# EasyEDA Pro project YYT_MiniOdrive_V2.6(最终版) .epro, board PCB_SimpleFOC
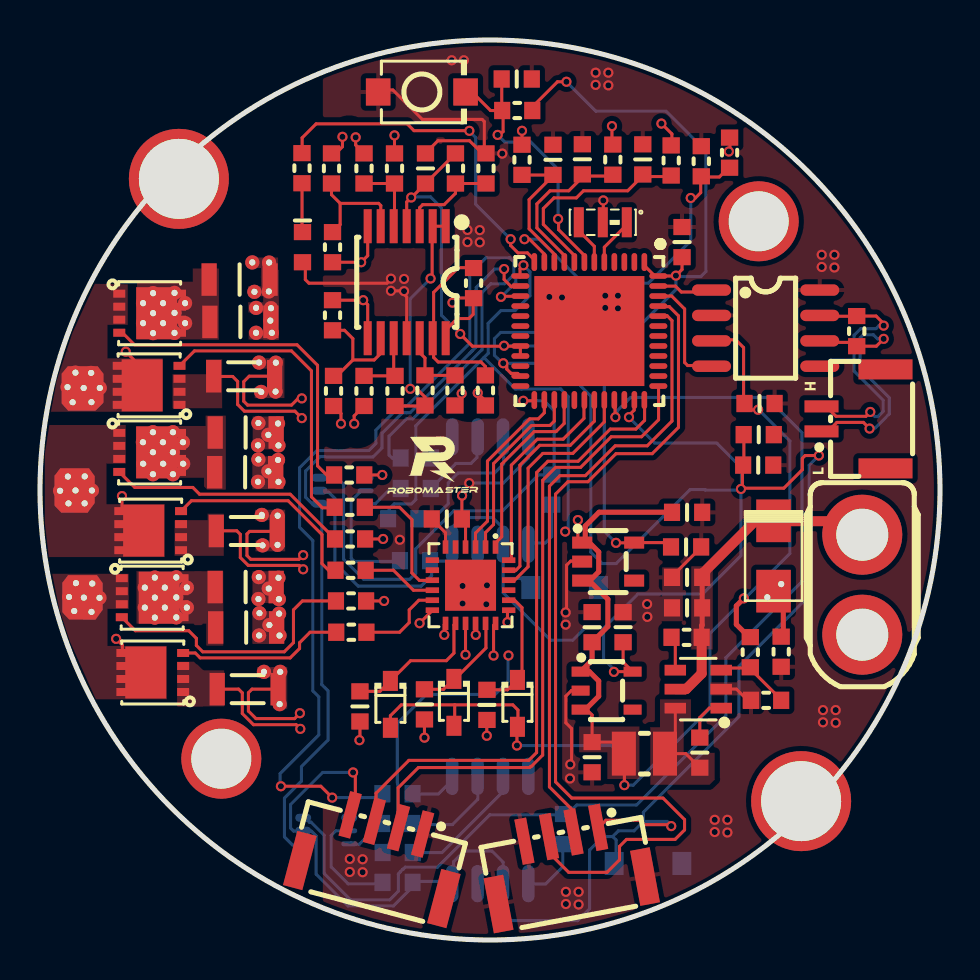
[diagram p1: board, top side]
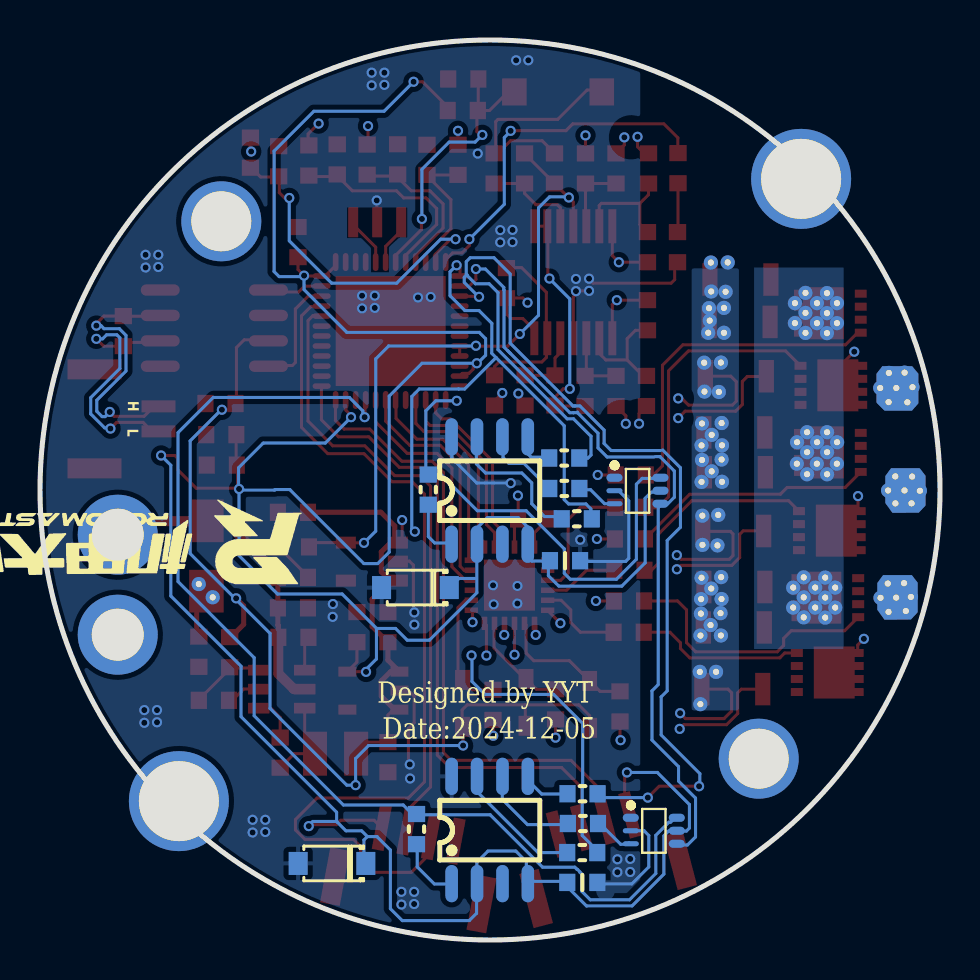
[diagram p2: board, bottom side, seen from below]

Outline 45 x 45 mm; copper layers: Top Layer, Inner1, Inner2, Bottom Layer. Coordinates in mm from the lower left corner of the outline.
Outline path: circle c22.5,22.5 r22.5
Stack: Top Layer 0.035mm 外层铜厚1oz / Dielectric1 0.2104mm 7628 RC49% 8.6mil / Inner1 0.0152mm 内层铜厚 / Dielectric2 1.065mm 1.1mm H/HOZ Copper / Inner2 0.0152mm 内层铜厚 / Dielectric3 0.2104mm 7628 RC49% 8.6mil / Bottom Layer 0.035mm 外层铜厚1oz

## Design rules (mm)
net CANH: DP1
net CANL: DP1
template: 用户自定义配置
spacing Default (default): track to track 0.152, other pairs 0 to 0.152
spacing copperThickness1oz: track to track 0.102, other pairs 0.152 to 0.3
spacing copperThickness2oz: track to track 0.203, other pairs 0.152 to 0.3
track width Default (default): min 0.152, default 0.254, max 25.4
track width copperThickness1oz: min 0.127, default 0.152, max 2.54
track width copperThickness2oz: min 0.203, default 0.254, max 2.54
differential pair differentialPair (default): width min 0.127, default 0.254, max 2.54; gap min 0.152, default 0.152
via Default (default): diameter min 0.5, default 0.5, max 100.025; hole min 0.305, default 0.305, max 59.995
via viaSize: diameter min 0.5, default 0.508, max 10; hole min 0.3, default 0.305, max 6.299
pour e9712 uses gge5858

## Placement (name value [footprint] x y rotation side)
C11  1uF  [C0603_SMALL]  22.35 11.76 90 top
C30  1uF  [C0603_SMALL]  32.3 19.66 180 top
C31  1uF  [C0603_SMALL]  32.35 21.38 180 top
C33  10uF  [C1206_SMALL]  10.02 30.91 180 top
C89  10uF  [C0603_SMALL]  27.61 15.64 270 top
C90  10uF  [C0603_SMALL]  29.16 15.64 270 top
C91  1nF  [C0603_SMALL]  25.65 39.01 270 top
C92  1nF  [C0603_SMALL]  27.12 39.03 270 top
C93  1nF  [C0603_SMALL]  30.14 39.03 270 top
C94  100nF  [C0603_SMALL]  19.27 38.58 270 top
C106  10uF  [C0603_SMALL]  20.34 21.05 180 top
C107  1uF  [C0603_SMALL]  16 11.68 90 top
C108  1uF  [C0603_SMALL]  19.22 11.78 90 top
C121  10uF  [C1206_SMALL]  10.26 23.39 180 top
C122  10uF  [C1206_SMALL]  10.31 15.63 180 top
C149  0.1uF  [C0603_SMALL]  35.91 23.74 180 top
C150  0.1uF  [C0603_SMALL]  35.94 25.27 180 top
C151  0.1uF  [C0603_SMALL]  32.1 34.89 270 top
C152  100nF  [C0603_SMALL]  32.99 9.37 270 top
C156  22uF  [C1206_SMALL]  9.98 33.02 0 top
C157  22uF  [C1206_SMALL]  10.28 25.38 0 top
C158  22uF  [C1206_SMALL]  10.28 17.65 0 top
C159  100nF  [C0603_SMALL]  32.35 16.61 180 top
C160  4.7uF  [C0603_SMALL]  32.35 18.13 180 top
C161  10uF  [C0603_SMALL]  27.61 9.14 270 top
C162  100nF  [C0603_SMALL]  23.84 43.05 0 top
C163  0.1uF  [C0603_SMALL]  18.75 18.97 0 bottom
C164  0.1uF  [C0603_SMALL]  17.88 2.88 0 bottom
C165  0.1uF  [C0603_SMALL]  35.98 26.82 0 top
CHIP_EN3  TS-1088-AR02016  [SW-SMD_L3.9-W3.0-P4.45]  19.09 42.4 0 top
CN1  XT30UPB-F  [CONN-TH_XT30UPB-F]  41.11 17.77 270 top
CN2  GH1.25-2P卧贴  [CONN-SMD_2P-P1.25_X1251WRS-02HF-LPSW]  40.68 26.06 90 top
D5  SMF5.0A  [SOD-123_L2.8-W1.8-LS3.7-RD]  26.23 17.62 0 bottom
D9  SMAJ18CA  [DO214AC]  36.68 19.2 90 top
D10  1N5819WS  [SOD-323_L1.8-W1.3-LS2.5-RD]  17.52 11.78 270 top
D11  1N5819WS  [SOD-323_L1.8-W1.3-LS2.5-RD]  20.7 11.88 270 top
D12  1N5819WS  [SOD-323_L1.8-W1.3-LS2.5-RD]  23.87 11.83 270 top
D14  SMF5.0A  [SOD-123_L2.8-W1.8-LS3.7-RD]  30.4 3.83 0 bottom
L3  22uH  [IND-SMD_L2.5-W2.0]  30.22 9.32 0 top
LED9  NCD0603B1  [LED0603_RED_SMALL]  13.12 34.64 270 top
NOREF  -  [Pad_e6]  1.38 27.64 0 top
NOREF#2  -  [Pad_e5391]  11.42 23.43 90 top
NOREF#3  -  [Pad_e32]  2.23 21.83 0 top
NOREF#4  -  [Pad_e345]  6.73 30.36 90 top
NOREF#5  -  [Pad_e254]  11.92 24.73 90 top
NOREF#6  -  [Pad_e92]  6.94 38.06 0 top
NOREF#7  -  [Pad_e340]  6.73 32.36 90 top
NOREF#8  -  [Pad_e483]  36.37 17.14 90 top
NOREF#9  -  [Pad_e39]  1.8 17.84 0 top
NOREF#10  -  [Pad_e316]  6.81 17.13 90 top
NOREF#11  -  [Pad_e5400]  11.94 17.05 90 top
NOREF#12  -  [Pad_e335]  5.65 31.34 90 top
NOREF#13  -  [Pad_e4221]  11.2 13.41 90 top
NOREF#14  -  [Pad_e342]  7.25 31.84 90 top
NOREF#15  -  [Pad_e0]  2.13 27.58 90 top
NOREF#16  -  [Pad_e1]  1.73 22.47 90 top
NOREF#17  -  [Pad_e8]  2.99 27.6 0 top
NOREF#18  -  [Pad_e344]  7.25 30.84 90 top
NOREF#19  -  [Pad_e114]  9.06 9.06 0 top
NOREF#20  -  [Pad_e5394]  11.92 22.91 90 top
NOREF#21  -  [Pad_e33]  2.19 17.12 0 top
NOREF#22  -  [Pad_e5404]  10.95 15.23 90 top
NOREF#23  -  [Pad_e333]  5.65 30.34 90 top
NOREF#24  -  [Pad_e27]  1.01 22.46 0 top
NOREF#25  -  [Pad_e244]  11.59 30.36 90 top
NOREF#26  -  [Pad_e320]  5.65 25.39 0 top
NOREF#27  -  [Pad_e322]  5.65 24.39 0 top
NOREF#28  -  [Pad_e338]  5.65 32.34 90 top
NOREF#29  -  [Pad_e5403]  10.97 16.34 90 top
NOREF#30  -  [Pad_e304]  12.01 13.41 90 top
NOREF#31  -  [Pad_e31]  1.42 21.83 0 top
NOREF#32  -  [Pad_e315]  7.34 17.62 90 top
NOREF#33  -  [Pad_e318]  7.34 16.62 90 top
NOREF#34  -  [Pad_e281]  11.88 21.21 90 top
NOREF#35  -  [Pad_e5393]  11.9 24 90 top
NOREF#36  -  [Pad_e5399]  10.92 17.05 90 top
NOREF#37  -  [Pad_e246]  11.55 31.59 90 top
NOREF#38  -  [Pad_e4692]  11.46 33.87 90 top
NOREF#39  -  [Pad_e5392]  10.92 24.03 90 top
NOREF#40  -  [Pad_e4231]  11.06 27.4 90 top
NOREF#41  -  [Pad_e768]  11.79 28.87 90 top
NOREF#42  -  [Pad_e307]  5.24 16.62 90 top
NOREF#43  -  [Pad_e29]  1.39 23.17 0 top
NOREF#44  -  [Pad_e38]  2.61 17.82 0 top
NOREF#45  -  [Pad_e313]  6.24 17.62 90 top
NOREF#46  -  [Pad_e326]  6.65 24.39 0 top
NOREF#47  -  [Pad_e253]  10.9 24.73 90 top
NOREF#48  -  [Pad_e319]  6.81 16.13 90 top
NOREF#49  -  [Pad_e325]  7.15 24.89 0 top
NOREF#50  -  [Pad_e314]  6.81 18.13 90 top
NOREF#51  -  [Pad_e3]  2.12 17.13 90 top
NOREF#52  -  [Pad_e280]  11.88 19.76 90 top
NOREF#53  -  [Pad_e42]  2.57 16.4 0 top
NOREF#54  -  [Pad_e5395]  10.9 22.91 90 top
NOREF#55  -  [Pad_e310]  5.74 17.12 90 top
NOREF#56  -  [Pad_e332]  5.15 30.84 90 top
NOREF#57  -  [Pad_e339]  6.15 31.84 90 top
NOREF#58  -  [Pad_e323]  6.15 24.89 0 top
NOREF#59  -  [Pad_e245]  11.51 30.97 90 top
NOREF#60  -  [Pad_e18]  2.57 26.89 0 top
NOREF#61  -  [Pad_e309]  6.24 16.62 90 top
NOREF#62  -  [Pad_e328]  6.65 23.29 0 top
NOREF#63  -  [Pad_e2]  1.73 22.47 90 top
NOREF#64  -  [Pad_e4689]  11.44 32.43 90 top
NOREF#65  -  [Pad_e26]  1.78 22.48 0 top
NOREF#66  -  [Pad_e482]  37.06 17.8 90 top
NOREF#67  -  [Pad_e28]  2.6 22.48 0 top
NOREF#68  -  [Pad_e4203]  11.09 21.25 90 top
NOREF#69  -  [Pad_e324]  6.65 25.39 0 top
NOREF#70  -  [Pad_e7]  2.18 27.6 0 top
NOREF#71  -  [Pad_e4691]  10.62 33.88 90 top
NOREF#72  -  [Pad_e9]  1.63 26.89 0 top
NOREF#73  -  [Pad_e5390]  11.42 25.26 90 top
NOREF#74  -  [Pad_e5398]  10.94 18.14 90 top
NOREF#75  -  [Pad_e308]  5.74 16.12 90 top
NOREF#76  -  [Pad_e5405]  11.98 15.22 90 top
NOREF#77  -  [Pad_e5]  2.56 28.35 0 top
NOREF#78  -  [Pad_e247]  10.8 31.61 90 top
NOREF#79  -  [Pad_e330]  5.65 23.29 0 top
NOREF#80  -  [Pad_e98]  38.06 6.94 0 top
NOREF#81  -  [Pad_e4199]  11.13 19.73 90 top
NOREF#82  -  [Pad_e343]  6.73 31.36 90 top
NOREF#83  -  [Pad_e4690]  10.72 32.41 90 top
NOREF#84  -  [Pad_e255]  11.9 25.83 90 top
NOREF#85  -  [Pad_e336]  5.15 31.84 90 top
NOREF#86  -  [Pad_e162]  2.13 27.58 90 top
NOREF#87  -  [Pad_e30]  2.24 23.18 0 top
NOREF#88  -  [Pad_e89]  35.94 35.94 0 top
NOREF#89  -  [Pad_e41]  1.71 16.45 0 top
NOREF#90  -  [Pad_e37]  2.97 17.11 0 top
NOREF#91  -  [Pad_e5402]  11.47 15.75 90 top
NOREF#92  -  [Pad_e311]  5.24 17.62 90 top
NOREF#93  -  [Pad_e4230]  10.95 28.87 90 top
NOREF#94  -  [Pad_e321]  5.15 24.89 0 top
NOREF#95  -  [Pad_e329]  6.16 23.81 0 top
NOREF#96  -  [Pad_e5397]  11.44 17.57 90 top
NOREF#97  -  [Pad_e303]  11.98 11.79 90 top
NOREF#98  -  [Pad_e40]  1.45 17.15 0 top
NOREF#99  -  [Pad_e331]  5.16 23.81 0 top
NOREF#100  -  [Pad_e4]  1.77 28.37 0 top
NOREF#101  -  [Pad_e769]  11.78 27.42 90 top
NOREF#102  -  [Pad_e257]  10.92 25.85 90 top
NOREF#103  -  [Pad_e334]  6.15 30.84 90 top
NOREF#104  -  [Pad_e5401]  11.95 16.32 90 top
NOREF#105  -  [Pad_e163]  2.12 17.13 90 top
NOREF#106  -  [Pad_e312]  5.74 18.12 90 top
NOREF#107  -  [Pad_e243]  10.8 30.36 90 top
NOREF#108  -  [Pad_e5396]  11.92 18.11 90 top
NOREF#109  -  [Pad_e327]  7.16 23.81 0 top
Q19  -  [DFN-8_L3.2-W3.1-P0.65-LS3.4-BL]  5.48 31.34 270 top
Q20  -  [DFN-8_L3.2-W3.1-P0.65-LS3.4-BL]  5.48 24.38 270 top
Q21  -  [DFN-8_L3.2-W3.1-P0.65-LS3.4-BL]  5.61 17.11 270 top
Q22  -  [DFN-8_L3.2-W3.1-P0.65-LS3.4-BL]  5.46 27.73 90 top
Q23  -  [DFN-8_L3.2-W3.1-P0.65-LS3.4-BL]  5.53 20.47 90 top
Q24  -  [DFN-8_L3.2-W3.1-P0.65-LS3.4-BL]  5.64 13.38 90 top
R20  1kΩ  [R0603_SMALL]  22.3 38.58 90 top
R21  1kΩ  [R0603_SMALL]  20.77 38.58 270 top
R23  10Ω  [R0603_SMALL]  15.55 16.95 180 top
R61  0Ω  [R0603_SMALL]  37.06 14.41 270 top
R67  100kΩ  [R0603_SMALL]  21.68 32.84 270 top
R71  100kΩ  [R0603_SMALL]  14.63 31.24 90 top
R75  100kΩ  [R0603_SMALL]  14.63 34.64 270 top
R76  100kΩ  [R0603_SMALL]  17.72 38.58 270 top
R77  100kΩ  [R0603_SMALL]  17.75 27.45 90 top
R78  100kΩ  [R0603_SMALL]  19.25 27.48 90 top
R79  2kΩ  [R0603_SMALL]  22.27 27.48 270 top
R80  2kΩ  [R0603_SMALL]  20.75 27.48 270 top
R81  2kΩ  [R0603_SMALL]  14.68 27.45 270 top
R82  2kΩ  [R0603_SMALL]  16.2 27.45 270 top
R83  2kΩ  [R0603_SMALL]  14.57 38.58 90 top
R84  2kΩ  [R0603_SMALL]  16.2 38.58 90 top
R85  22Ω  [R0603_SMALL]  24.1 39.01 90 top
R86  22Ω  [R0603_SMALL]  28.64 39.02 90 top
R87  22Ω  [R0603_SMALL]  31.56 38.98 90 top
R92  10kΩ  [R0603_SMALL]  32.33 15.13 180 top
R93  10kΩ  [R0603_SMALL]  36.31 11.98 180 top
R94  52.3kΩ  [R0603_SMALL]  35.51 14.39 270 top
R106  10Ω  [R0603_SMALL]  15.46 23.25 180 top
R107  10Ω  [R0603_SMALL]  15.49 21.64 180 top
R108  10Ω  [R0603_SMALL]  15.5 20.05 180 top
R109  10Ω  [R0603_SMALL]  15.53 18.49 180 top
R110  10Ω  [R0603_SMALL]  15.57 15.39 180 top
R116  4.7kΩ  [R0603_SMALL]  13.1 38.59 270 top
R117  10kΩ  [R0603_SMALL]  23.86 41.47 180 top
R118  10kΩ  [R0603_SMALL]  34.48 39.37 90 top
R119  1kΩ  [R0603_SMALL]  33.06 38.94 270 top
R120  22Ω  [R0603_SMALL]  25.59 22.52 270 bottom
R121  22Ω  [R0603_SMALL]  18.16 21.06 0 bottom
R122  22Ω  [R0603_SMALL]  18.78 22.58 0 bottom
R123  22Ω  [R0603_SMALL]  18.79 24.1 0 bottom
R124  22Ω  [R0603_SMALL]  26.18 5.55 270 bottom
R125  22Ω  [R0603_SMALL]  17.89 4.37 0 bottom
R126  22Ω  [R0603_SMALL]  17.85 5.83 0 bottom
R127  22Ω  [R0603_SMALL]  17.87 7.31 0 bottom
R128  120  [R0603_SMALL]  40.84 30.44 90 top
U13  LP5907MFX-3.3/NOPB  [SOT-23-5_L3.0-W1.7-P0.95-LS2.8-BR]  28.41 18.92 180 top
U16  RS724XQ  [TSSOP-14_L5.0-W4.4-P0.65-LS6.4-BL]  18.33 32.89 180 top
U19  LGS5148  [SOT-23-6_L2.9-W1.6-P0.95-LS2.8-BL]  32.91 12.54 90 top
U20  FD6288Q  [QFN-24_L4.0-W4.0-P0.50-BL-EP2.6]  21.53 17.74 180 top
U60  STM32G431CBU6  [UFQFPN-48_L7.0-W7.0-P0.50-BL-EP]  27.47 30.45 180 top
U61  XC6210B332MR  [SOT-25_L3.0-W1.6-P0.95-LS2.8-BL]  28.33 12.47 270 top
U63  2mΩ  [R1206_SMALL]  10.21 28.19 180 top
U64  2mΩ  [R1206_SMALL]  10.34 20.45 180 top
U65  2mΩ  [R1206_SMALL]  10.38 12.54 180 top
U66  GH1.25-4P卧贴  [CONN-SMD_4P-P1.25_GH1.25-4P]  16.96 4.4 345.2 top
U67  GH1.25-4P卧贴  [CONN-SMD_4P-P1.25_GH1.25-4P]  26.33 3.89 10.6 top
U70  MT6816CT-STD  [SOP-8_L4.9-W3.9-P1.27-LS6.0-BL]  22.52 22.47 180 bottom
U71  MT6816CT-STD  [SOP-8_L4.9-W3.9-P1.27-LS6.0-BL]  22.51 5.5 180 bottom
U72  CH443K  [SC70-6_L2.1-W1.3-P0.65-LS2.3-BL]  15.13 22.46 270 bottom
U73  CH443K  [SC70-6_L2.1-W1.3-P0.65-LS2.3-BL]  14.31 5.46 270 bottom
U74  TJA1050T/CM,118  [soic-8_l5.0-w4.0-p1.27-ls6.0-bl]  36.28 30.59 270 top
X1  村田8MHz  [OSC-SMD_3P-L3.2-W1.3-P1.20]  28.14 35.89 180 top

## Footprints (pads in the part's own frame, mm; a bottom-side part is the same pattern mirrored in y, then rotated)
C0603_SMALL
  rect 0.806x0.864 smd: 1(-0.753,0) 2(0.753,0)
C1206_SMALL
  rect 0.762x1.625 smd: 1(-1.524,0) 2(1.524,0)
CONN-SMD_2P-P1.25_X1251WRS-02HF-LPSW
  rect 0.6x1.7 smd: 1(-0.625,1.6) 2(0.625,1.6)
  rect 1x2.7 smd: 3(2.475,-1.6) 4(-2.475,-1.6)
CONN-SMD_4P-P1.25_GH1.25-4P
  rect 0.6x2.3 smd: 1(1.875,1.425) 2(0.625,1.425) 3(-0.625,1.425) 4(-1.875,1.425)
  rect 1x2.8 smd: 5(-3.725,-1.425) 6(3.725,-1.425)
CONN-TH_XT30UPB-F
  round 4 hole 2.601: 1(-2.499,0) 2(2.499,0)
DFN-8_L3.2-W3.1-P0.65-LS3.4-BL
  rect 0.399x0.6 smd: 1(-0.976,-1.519) 2(-0.325,-1.519) 3(0.325,-1.519) 4(0.976,-1.519) 5(0.976,1.519) 6(0.325,1.519) 7(-0.325,1.519) 8(-0.976,1.519)
  rect 2.601x2.05 smd: 9(0,0.35)
DO214AC
  rect 2.134x1.727 smd: 1(-1.758,0) 2(1.758,0)
IND-SMD_L2.5-W2.0
  rect 1.199x2.2 smd: 1(1.028,0) 2(-1.028,0)
LED0603_RED_SMALL
  rect 0.806x0.864 smd: 1(0.753,0) 2(-0.753,0)
OSC-SMD_3P-L3.2-W1.3-P1.20
  rect 0.5x1.5 smd: 1(-1.2,0) 2(0,0) 3(1.2,0)
Pad_e0
  custom 0x0 smd far side: 1(0,0)
Pad_e1
  custom 0x0 smd: 1(0,0)
Pad_e2
  custom 0x0 smd far side: 1(0,0)
Pad_e3
  custom 0x0 smd far side: 1(0,0)
Pad_e4
  round 0.711 hole 0.31x0.305: (0,0)
Pad_e5
  round 0.711 hole 0.31x0.305: (0,0)
Pad_e6
  round 0.711 hole 0.31x0.305: (0,0)
Pad_e7
  round 0.711 hole 0.31x0.305: (0,0)
Pad_e8
  round 0.711 hole 0.31x0.305: (0,0)
Pad_e9
  round 0.711 hole 0.31x0.305: (0,0)
Pad_e18
  round 0.711 hole 0.31x0.305: (0,0)
Pad_e26
  round 0.711 hole 0.31x0.305: (0,0)
Pad_e27
  round 0.711 hole 0.31x0.305: (0,0)
Pad_e28
  round 0.711 hole 0.31x0.305: (0,0)
Pad_e29
  round 0.711 hole 0.31x0.305: (0,0)
Pad_e30
  round 0.711 hole 0.31x0.305: (0,0)
Pad_e31
  round 0.711 hole 0.31x0.305: (0,0)
Pad_e32
  round 0.711 hole 0.31x0.305: (0,0)
Pad_e33
  round 0.711 hole 0.31x0.305: (0,0)
Pad_e37
  round 0.711 hole 0.31x0.305: (0,0)
Pad_e38
  round 0.711 hole 0.31x0.305: (0,0)
Pad_e39
  round 0.711 hole 0.31x0.305: (0,0)
Pad_e40
  round 0.711 hole 0.31x0.305: (0,0)
Pad_e41
  round 0.711 hole 0.31x0.305: (0,0)
Pad_e42
  round 0.711 hole 0.31x0.305: (0,0)
Pad_e89
  round 4 hole 3: 3(0,0)
Pad_e92
  round 5 hole 4: 1(0,0)
Pad_e98
  round 5 hole 4: 4(0,0)
Pad_e114
  round 4 hole 3: 1(0,0)
Pad_e162
  custom 0x0 smd: 1(0,0)
Pad_e163
  custom 0x0 smd: 1(0,0)
Pad_e243
  round 0.711 hole 0.31x0.305: (0,0)
Pad_e244
  round 0.711 hole 0.31x0.305: (0,0)
Pad_e245
  round 0.711 hole 0.31x0.305: (0,0)
Pad_e246
  round 0.711 hole 0.31x0.305: (0,0)
Pad_e247
  round 0.711 hole 0.31x0.305: (0,0)
Pad_e253
  round 0.711 hole 0.31x0.305: (0,0)
Pad_e254
  round 0.711 hole 0.31x0.305: (0,0)
Pad_e255
  round 0.711 hole 0.31x0.305: (0,0)
Pad_e257
  round 0.711 hole 0.31x0.305: (0,0)
Pad_e280
  round 0.711 hole 0.31x0.305: (0,0)
Pad_e281
  round 0.711 hole 0.31x0.305: (0,0)
Pad_e303
  round 0.711 hole 0.31x0.305: (0,0)
Pad_e304
  round 0.711 hole 0.31x0.305: (0,0)
Pad_e307
  round 0.711 hole 0.31x0.305: (0,0)
Pad_e308
  round 0.711 hole 0.31x0.305: (0,0)
Pad_e309
  round 0.711 hole 0.31x0.305: (0,0)
Pad_e310
  round 0.711 hole 0.31x0.305: (0,0)
Pad_e311
  round 0.711 hole 0.31x0.305: (0,0)
Pad_e312
  round 0.711 hole 0.31x0.305: (0,0)
Pad_e313
  round 0.711 hole 0.31x0.305: (0,0)
Pad_e314
  round 0.711 hole 0.31x0.305: (0,0)
Pad_e315
  round 0.711 hole 0.31x0.305: (0,0)
Pad_e316
  round 0.711 hole 0.31x0.305: (0,0)
Pad_e318
  round 0.711 hole 0.31x0.305: (0,0)
Pad_e319
  round 0.711 hole 0.31x0.305: (0,0)
Pad_e320
  round 0.711 hole 0.31x0.305: (0,0)
Pad_e321
  round 0.711 hole 0.31x0.305: (0,0)
Pad_e322
  round 0.711 hole 0.31x0.305: (0,0)
Pad_e323
  round 0.711 hole 0.31x0.305: (0,0)
Pad_e324
  round 0.711 hole 0.31x0.305: (0,0)
Pad_e325
  round 0.711 hole 0.31x0.305: (0,0)
Pad_e326
  round 0.711 hole 0.31x0.305: (0,0)
Pad_e327
  round 0.711 hole 0.31x0.305: (0,0)
Pad_e328
  round 0.711 hole 0.31x0.305: (0,0)
Pad_e329
  round 0.711 hole 0.31x0.305: (0,0)
Pad_e330
  round 0.711 hole 0.31x0.305: (0,0)
Pad_e331
  round 0.711 hole 0.31x0.305: (0,0)
Pad_e332
  round 0.711 hole 0.31x0.305: (0,0)
Pad_e333
  round 0.711 hole 0.31x0.305: (0,0)
Pad_e334
  round 0.711 hole 0.31x0.305: (0,0)
Pad_e335
  round 0.711 hole 0.31x0.305: (0,0)
Pad_e336
  round 0.711 hole 0.31x0.305: (0,0)
Pad_e338
  round 0.711 hole 0.31x0.305: (0,0)
Pad_e339
  round 0.711 hole 0.31x0.305: (0,0)
Pad_e340
  round 0.711 hole 0.31x0.305: (0,0)
Pad_e342
  round 0.711 hole 0.31x0.305: (0,0)
Pad_e343
  round 0.711 hole 0.31x0.305: (0,0)
Pad_e344
  round 0.711 hole 0.31x0.305: (0,0)
Pad_e345
  round 0.711 hole 0.31x0.305: (0,0)
Pad_e482
  round 0.711 hole 0.31x0.305: (0,0)
Pad_e483
  round 0.711 hole 0.31x0.305: (0,0)
Pad_e768
  round 0.711 hole 0.31x0.305: (0,0)
Pad_e769
  round 0.711 hole 0.31x0.305: (0,0)
Pad_e4199
  round 0.711 hole 0.31x0.305: (0,0)
Pad_e4203
  round 0.711 hole 0.31x0.305: (0,0)
Pad_e4221
  round 0.711 hole 0.31x0.305: (0,0)
Pad_e4230
  round 0.711 hole 0.31x0.305: (0,0)
Pad_e4231
  round 0.711 hole 0.31x0.305: (0,0)
Pad_e4689
  round 0.711 hole 0.31x0.305: (0,0)
Pad_e4690
  round 0.711 hole 0.31x0.305: (0,0)
Pad_e4691
  round 0.711 hole 0.31x0.305: (0,0)
Pad_e4692
  round 0.711 hole 0.31x0.305: (0,0)
Pad_e5390
  round 0.711 hole 0.31x0.305: (0,0)
Pad_e5391
  round 0.711 hole 0.31x0.305: (0,0)
Pad_e5392
  round 0.711 hole 0.31x0.305: (0,0)
Pad_e5393
  round 0.711 hole 0.31x0.305: (0,0)
Pad_e5394
  round 0.711 hole 0.31x0.305: (0,0)
Pad_e5395
  round 0.711 hole 0.31x0.305: (0,0)
Pad_e5396
  round 0.711 hole 0.31x0.305: (0,0)
Pad_e5397
  round 0.711 hole 0.31x0.305: (0,0)
Pad_e5398
  round 0.711 hole 0.31x0.305: (0,0)
Pad_e5399
  round 0.711 hole 0.31x0.305: (0,0)
Pad_e5400
  round 0.711 hole 0.31x0.305: (0,0)
Pad_e5401
  round 0.711 hole 0.31x0.305: (0,0)
Pad_e5402
  round 0.711 hole 0.31x0.305: (0,0)
Pad_e5403
  round 0.711 hole 0.31x0.305: (0,0)
Pad_e5404
  round 0.711 hole 0.31x0.305: (0,0)
Pad_e5405
  round 0.711 hole 0.31x0.305: (0,0)
QFN-24_L4.0-W4.0-P0.50-BL-EP2.6
  rect 0.28x0.665 smd: 1(-1.25,-1.907) 2(-0.75,-1.907) 3(-0.25,-1.907) 4(0.25,-1.907) 5(0.75,-1.907) 6(1.25,-1.907) 13(1.25,1.907) 14(0.75,1.907) 15(0.25,1.907) 16(-0.25,1.907) 17(-0.75,1.907) 18(-1.25,1.907)
  rect 0.665x0.28 smd: 7(1.907,-1.25) 8(1.907,-0.75) 9(1.907,-0.25) 10(1.907,0.25) 11(1.907,0.75) 12(1.907,1.25) 19(-1.907,1.25) 20(-1.907,0.75) 21(-1.907,0.25) 22(-1.907,-0.25) 23(-1.907,-0.75) 24(-1.907,-1.25)
  rect 2.55x2.55 smd: 25(0,0)
R0603_SMALL
  rect 0.806x0.864 smd: 1(-0.753,0) 2(0.753,0)
R1206_SMALL
  rect 0.762x1.625 smd: 1(-1.524,0) 2(1.524,0)
SC70-6_L2.1-W1.3-P0.65-LS2.3-BL
  oval 0.4x0.8 smd: 1(-0.65,-1.149) 4(0.65,1.15) 5(0,1.15) 6(-0.65,1.15)
  oval 0.25x0.8 smd: 2(0,-1.149) 3(0.65,-1.149)
SOD-123_L2.8-W1.8-LS3.7-RD
  rect 0.95x1.15 smd: 1(-1.692,0) 2(1.692,0)
SOD-323_L1.8-W1.3-LS2.5-RD
  rect 1x0.75 smd: 1(-1.173,0) 2(1.173,0)
soic-8_l5.0-w4.0-p1.27-ls6.0-bl
  oval 0.569x1.95 smd: 1(-1.905,-2.705) 2(-0.635,-2.705) 3(0.635,-2.705) 4(1.905,-2.705) 5(1.905,2.705) 6(0.635,2.705) 7(-0.635,2.705) 8(-1.905,2.705)
SOP-8_L4.9-W3.9-P1.27-LS6.0-BL
  oval 0.63x1.865 smd: 1(-1.905,-2.683) 2(-0.635,-2.683) 3(0.635,-2.683) 4(1.905,-2.683) 5(1.905,2.683) 6(0.635,2.683) 7(-0.635,2.683) 8(-1.905,2.683)
SOT-23-5_L3.0-W1.7-P0.95-LS2.8-BR
  rect 1x0.6 smd: 1(1.3,-0.95) 2(1.3,0) 3(1.3,0.95) 4(-1.3,0.95) 5(-1.3,-0.95)
SOT-23-6_L2.9-W1.6-P0.95-LS2.8-BL
  rect 0.532x1.072 smd: 1(-0.95,-1.149) 2(0,-1.149) 3(0.95,-1.149) 4(0.95,1.149) 5(0,1.149) 6(-0.95,1.149)
SOT-25_L3.0-W1.6-P0.95-LS2.8-BL
  rect 0.5x0.899 smd: 1(-0.95,-1.3) 2(0,-1.3) 3(0.95,-1.3) 4(0.95,1.3) 5(-0.95,1.3)
SW-SMD_L3.9-W3.0-P4.45
  rect 1.23x1.36 smd: 1(-2.185,0) 2(2.185,0)
TSSOP-14_L5.0-W4.4-P0.65-LS6.4-BL
  rect 0.4x1.7 smd: 1(-1.95,-2.8) 2(-1.3,-2.8) 3(-0.65,-2.8) 4(0,-2.8) 5(0.65,-2.8) 6(1.3,-2.8) 7(1.95,-2.8) 8(1.95,2.8) 9(1.3,2.8) 10(0.65,2.8) 11(0,2.8) 12(-0.65,2.8) 13(-1.3,2.8) 14(-1.95,2.8)
UFQFPN-48_L7.0-W7.0-P0.50-BL-EP
  oval 0.28x0.9 smd: 1(-2.751,-3.45) 2(-2.251,-3.45) 3(-1.75,-3.45) 4(-1.25,-3.45) 5(-0.749,-3.45) 6(-0.249,-3.45) 7(0.249,-3.45) 8(0.75,-3.45) 9(1.25,-3.45) 10(1.75,-3.45) 11(2.251,-3.45) 12(2.751,-3.45) 25(2.751,3.449) 26(2.251,3.449) 27(1.75,3.449) 28(1.25,3.449) 29(0.75,3.449) 30(0.249,3.449) 31(-0.249,3.449) 32(-0.749,3.449) 33(-1.25,3.449) 34(-1.75,3.449) 35(-2.251,3.449) 36(-2.751,3.449)
  oval 0.9x0.28 smd: 13(3.45,-2.751) 14(3.45,-2.251) 15(3.45,-1.75) 16(3.45,-1.25) 17(3.45,-0.75) 18(3.45,-0.249) 19(3.45,0.249) 20(3.45,0.749) 21(3.45,1.25) 22(3.45,1.75) 23(3.45,2.251) 24(3.45,2.751) 37(-3.449,2.751) 38(-3.449,2.251) 39(-3.449,1.75) 40(-3.449,1.25) 41(-3.449,0.749) 42(-3.449,0.249) 43(-3.449,-0.249) 44(-3.449,-0.75) 45(-3.449,-1.25) 46(-3.449,-1.75) 47(-3.449,-2.251) 48(-3.449,-2.751)
  rect 5.5x5.5 smd: 49(0,0)

## Nets
As in the schematic, except:
PGND: C33.1 C121.1 C122.1 C156.2 C157.2 C158.2 CN1.2 D9.1 NOREF#2. NOREF#5. NOREF#8. NOREF#11. NOREF#13. NOREF#20. NOREF#22. NOREF#25. NOREF#29. NOREF#30. NOREF#34. NOREF#35. NOREF#36. NOREF#37. NOREF#38. NOREF#39. NOREF#40. NOREF#41. NOREF#47. NOREF#52. NOREF#54. NOREF#59. NOREF#64. NOREF#66. NOREF#68. NOREF#71. NOREF#73. NOREF#74. NOREF#76. NOREF#78. NOREF#81. NOREF#83. NOREF#84. NOREF#91. NOREF#93. NOREF#96. NOREF#97. NOREF#101. NOREF#102. NOREF#104. NOREF#107. NOREF#108. R61.1 R80.2 R82.2 R84.2 U63.1 U64.1 U65.1
DCBUS: C33.2 C121.2 C122.2 C156.1 C157.1 C158.1 C159.1 C160.1 CN1.1 D9.2 NOREF#4. NOREF#7. NOREF#10. NOREF#12. NOREF#14. NOREF#18. NOREF#23. NOREF#26. NOREF#27. NOREF#28. NOREF#32. NOREF#33. NOREF#42. NOREF#45. NOREF#46. NOREF#48. NOREF#49. NOREF#50. NOREF#55. NOREF#56. NOREF#57. NOREF#58. NOREF#61. NOREF#62. NOREF#69. NOREF#75. NOREF#79. NOREF#82. NOREF#85. NOREF#92. NOREF#94. NOREF#95. NOREF#99. NOREF#103. NOREF#106. NOREF#109. Q19.5 Q19.6 Q19.7 Q19.8 Q19.9 Q20.5 Q20.6 Q20.7 Q20.8 Q20.9 Q21.5 Q21.6 Q21.7 Q21.8 Q21.9 R92.1 R118.2 U19.5
M0_SH_A: C107.1 NOREF. NOREF#15.1 NOREF#17. NOREF#60. NOREF#70. NOREF#72. NOREF#77. NOREF#86.1 NOREF#100. Q19.1 Q19.2 Q19.3 Q22.5 Q22.6 Q22.7 Q22.8 Q22.9 U20.12
M0_SH_B: C108.1 NOREF#3. NOREF#16.1 NOREF#24. NOREF#31. NOREF#43. NOREF#63.1 NOREF#65. NOREF#67. NOREF#87. Q20.1 Q20.2 Q20.3 Q23.5 Q23.6 Q23.7 Q23.8 Q23.9 U20.15
M0_SH_C: C11.1 NOREF#9. NOREF#21. NOREF#44. NOREF#51.1 NOREF#53. NOREF#89. NOREF#90. NOREF#98. NOREF#105.1 Q21.1 Q21.2 Q21.3 Q24.5 Q24.6 Q24.7 Q24.8 Q24.9 U20.18

Pads without a net: CN2 3 4; NOREF#6 1; NOREF#19 1; NOREF#80 4; NOREF#88 3; U13 4; U20 5 7 8 21; U60 2 3 4 16 17 18 19 22 24 29 34 38 39 40 41; U61 4; U66 5 6; U70 3; U71 3; U72 1; U73 1; U74 5

## Via types
v1: diameter 0.508, hole 0.305, Top Layer to Bottom Layer, 129 vias

## Routing (per net, layer and track width the routed paths; a pad name or vN(x,y) marks a point on that pad's centre or on a via; arc(x,y) is an arc through that point)
5V: length 81
  Top Layer w0.152: U20.4 21.28,20.87 C106.1 21.09,22.21 v1(21.1,22.22) ; v1(26.89,21) 26.89,20.08 U13.1 ; v1(35.91,26.51) 35.49,26.51 35.21,26.79 ; 27.46,17.97 U13.3 ; v1(23.85,9.72) 23.85,10.63 D12.2 23.9,10.68 23.9,11.5 23.64,11.76 20.73,11.76 ; D10.2 17.52,11.21 18.06,11.76 20.73,11.76 ; 20.73,11.76 20.73,10.75 D11.2 ; v1(29.22,7.74) 29.22,9.29 28.62,9.89 C161.1 27.61,11.25 27.34,11.52 U61.3 ; 35.18,26.81 35.18,29.62 34.79,30.01 33.52,30.01
  Top Layer w0.254: v1(35.19,17.08) 34.82,16.71 34.82,15.78 35.49,15.11 35.49,15.11 35.49,15.12 ; 27.22,19.88 27.26,19.92 27.26,20.7 27.95,21.39 31.57,21.39 ; U13.1 27.47,19.87 27.94,19.4 27.94,18.41 27.49,17.97 27.46,17.97 28.39,17.04 28.39,15.68 C89.2 27.61,13.99 U61.1 27.47,13.42 27.93,12.95 27.93,12.19 27.27,11.52
  Inner2 w0.152: v1(26.89,21) 25.68,21 25.34,21.33 25.34,21.84 24.96,22.22 v1(21.1,22.22)
  Bottom Layer w0.152: 35.27,17.01 35.27,17.1 37.49,19.32 37.49,24.96 35.94,26.51 v1(35.91,26.51) ; 35.27,17.01 v1(35.19,17.08) ; 35.27,17.01 35.27,17 35.17,17 33.5,15.33 33.5,11.58 29.66,7.74 v1(29.22,7.74) 29.22,9.08 28.57,9.72 v1(23.85,9.72)
AVCC: length 34.5
  Top Layer w0.152: R21.1 20.77,39.32 C94.2 18.58,37.13 v1(18.56,37.13) 18.33,36.9 U16.4 ; U60.21 24.02,29.68 24.01,29.69 ; 24.01,29.69 24.02,29.7 ; 24.01,29.69 21.62,29.69 v1(21.01,30.3) ; C30.2 31.34,19.87 U13.5 29.7,19.86 v1(28.8,19.86)
  Bottom Layer w0.152: 23.19,29.69 23.2,29.7 27.57,29.7 28.22,29.05 28.22,20.44 v1(28.8,19.86) ; v1(18.56,37.13) 18.59,37.16 19.53,37.16 20.07,36.61 20.07,31.24 v1(21.01,30.3)
  vias: v1(23.2,29.71)
GND: length 49.7
  Top Layer w0.152: C106.2 20.28,20.36 U20.6 ; v1(17.55,32.46) 18.03,32.46 18.33,32.15 U16.11 ; X1.2 28.16,35.91 v1(28.16,36.98) ; 35.62,11.97 35.4,11.97 34.82,12.55 34.12,12.55 ; 31.62,17.97 31.62,18.2 33.03,19.61 ; 22.27,39.47 22.22,39.52 22.22,40.92 22.11,41.03 19.12,41.03 17.65,42.5 17.08,42.5 16.93,42.35 ; 17.53,33.02 17.35,32.84 13.45,32.84 13.27,33.02 13.27,33.78 13.19,33.86 ; 26.33,16.42 26.33,18.74 26.53,18.95 27.08,18.95 ; 19.39,39.35 19.39,39.45 19.89,39.96 21.47,39.96 22.09,39.35 22.3,39.35 22.33,39.32 ; 26.85,12.47 26.57,12.47 26.29,12.19 26.29,10.86 26.58,10.57 26.58,8.74
  Bottom Layer w0.152: 17.07,2.81 15.41,2.81 14.56,3.65 14.56,5.23 14.8,5.46 15.4,5.46 ; 18.02,18.93 15.71,18.93 15.56,19.08 15.56,21.96 16.06,22.45 16.27,22.45 ; 21.41,22.85 23.17,22.85 24.41,24.09 24.41,25.21
  vias: v1(15.49,4.05) v1(15.49,3.4) v1(16.13,4.04) v1(16.13,3.39) v1(17.55,33.07) v1(17.99,20.01) v1(18.2,33.05) v1(18.2,32.44) v1(20.58,43.99) v1(21.13,17.7) v1(21.13,16.82) v1(21.19,43.99) v1(21.37,35.5) v1(21.37,34.89) v1(21.46,22.84) v1(21.99,35.49) v1(21.99,34.88) v1(22.35,17.73) v1(22.32,16.78) v1(23.11,39.32) v1(25.47,32.15) v1(26.1,32.13) v1(26.28,16.38) v1(26.28,15.77) v1(26.29,2.41) v1(26.29,1.8) v1(26.51,8.78) v1(26.5,8.08) v1(26.93,2.41) v1(26.93,1.77) v1(27.78,43.37) v1(27.78,42.76) v1(28.26,32.22) v1(28.26,31.61) v1(28.42,43.37) v1(28.42,42.73) v1(28.9,32.22) v1(28.9,31.58) v1(30.36,16.8) v1(30.37,16.16) v1(33.74,6.01) v1(33.74,5.4) v1(34.37,6.01) v1(34.37,5.38) v1(39.09,34.26) v1(39.09,33.65) v1(39.15,11.5) v1(39.15,10.89) v1(39.72,34.26) v1(39.72,33.62) v1(39.78,11.5) v1(39.78,10.86)
PGND: length 69.9
  Top Layer w0.152: v1(15.78,40.13) 15.78,39.75 R84.2 ; 11.91,20.45 11.89,20.43 10.48,20.43 10.35,20.3 10.35,19.22 10.54,19.03 12.95,19.03 v1(13.16,19.24) ; v1(15.71,25.81) 15.71,26.21 R82.2 ; 20.76,26.74 21.08,27.06 21.08,27.33 ; 11.77,28.12 11.69,28.19 10.46,28.19 10.19,27.92 10.19,26.94 10.38,26.75 12.58,26.75 12.91,27.08 v1(13.09,27.08) ; U65.1 10.6,12.54 10.42,12.36 10.42,11.45 10.8,11.07 12.73,11.07 12.99,11.33 v1(12.99,11.34)
  Top Layer w0.254: 36.82,17.11 37.17,16.76 37.17,15.21 37.01,15.06
  Inner1 w0.152: v1(12.99,11.34) 13.23,11.11 13.63,11.11 13.79,11.26 13.79,21.79 17.68,25.68 20.55,25.68 21.31,26.44 21.31,27.09 v1(21.08,27.32) ; v1(13.16,19.24) 12.98,19.42 12.98,21.97 15.56,24.55 15.56,25.5 15.71,25.66 v1(15.71,25.81) ; v1(13.09,27.08) 13.39,26.78 13.66,26.78 13.84,26.95 13.84,41.13 14.28,41.57 15.2,41.57 15.62,41.15 15.62,40.3 v1(15.78,40.13)
VBUS: length 16.9
  Top Layer w0.152: 33.05,38.15 33.97,38.15 34.46,38.64 ; v1(32.54,37.1) 32.77,37.1 33.04,37.37 33.04,38.07 ; v1(24.22,35.04) 24.47,35.04 25.21,34.3 25.21,33.88
  Bottom Layer w0.152: v1(24.22,35.04) 24.97,35.04 27.16,32.84 30.42,32.84 32.54,34.96 v1(32.54,37.1)
VCC: length 180.2
  Top Layer w0.152: 35.19,25.27 35.19,23.81 35.12,23.74 ; C90.2 29.16,13.89 U61.5 28.71,13.42 v1(28.7,13.41) ; U60.1 30.22,33.72 30.74,33.2 U60.48 31.78,33.2 v1(31.8,33.22) 32.1,33.52 C151.2 ; 27.96,5.66 28.3,5.99 29.96,5.99 30.18,5.77 31.48,5.77 ; 29.49,26.27 29.71,26.49 29.71,26.73 ; 15.49,6.25 15.77,6.53 15.77,8.26 v1(15.65,8.38) ; U60.23 23.89,28.33 23.56,28.33 23.34,28.55 23.34,28.84 v1(23.16,28.84) ; v1(38.95,24.22) 38.26,24.22 38.12,24.08 38.12,23.52 37.19,22.59 35.19,22.59 ; v1(26.32,42.91) 25.87,42.91 24.64,41.68 ; 35.12,23.65 35.12,22.47
  Bottom Layer w0.152: 30.17,5.93 30.16,5.93 30.14,5.9 ; 30.17,5.93 31.36,5.93 31.56,5.72 ; 30.17,5.93 30.14,5.9 ; 30.17,5.93 30.17,6.39 34.95,11.16 34.95,13.69 38.46,17.2 38.46,23.74 v1(38.95,24.22) ; 28.63,5.17 28.63,5.17 ; 35.07,22.62 35.07,23.61 33.84,24.85 30.73,24.85 29.49,26.09 ; 18.66,2.69 17.68,1.71 15.4,1.71 13.81,3.29 13.81,5.21 13.56,5.45 13.27,5.45 ; 28.81,13.42 28.18,14.05 28.18,15.59 29.89,17.3 33.13,17.3 35.05,19.22 35.05,22.49 33.26,22.49 33.24,22.52 32.51,22.52 28.81,18.82 28.11,18.82 27.54,19.39 27.54,27.19 25.9,28.84 v1(23.16,28.84) 23.12,28.84 22.72,29.24 22.72,30.06 23.04,30.38 29.66,30.38 31.8,32.52 v1(31.8,33.22) 31.85,33.17 33.04,33.17 33.29,33.42 33.29,39.45 31.31,41.44 27.8,41.44 v1(26.32,42.91) ; 28.63,5.17 28.15,5.17 27.48,4.5 27.48,1.56 26.88,0.97 23.54,0.97 23.17,1.33 23.17,2.8 ; 28.63,5.17 28.66,5.17 ; 28.63,5.17 28.8,5 28.8,3.83 28.65,3.68 ; 24.51,17.61 24.05,18.08 23.25,18.08 ; 13.97,22.39 14.43,22.39 14.74,22.08 14.74,18.86 15.91,17.69 19.06,17.69 19.58,18.22 19.58,18.82 ; 13.17,5.45 13.16,5.45 12.68,5.45 12.53,5.6 12.53,6.77 14.13,8.38 v1(15.65,8.38) ; 23.16,19.81 23.16,17.36 25.53,14.99 26.64,14.99 27.22,15.58 28.17,15.58 ; 20.57,19.11 20.4,18.95 19.62,18.95 19.56,18.88 ; 24.51,17.27 24.51,17.58 ; 30.14,5.9 29.7,5.46 28.92,5.46 28.64,5.18 ; 20.57,2.86 20.57,2.89 20.68,3.01 20.68,3.92 21.21,4.45 22.6,4.45 23.16,3.89 23.16,2.87 ; 20.53,2.82 20.41,2.93 18.84,2.93 18.64,2.73 ; 20.6,19.97 20.6,20.63 21.09,21.12 22.63,21.12 23.16,20.59 23.16,19.82
  vias: v1(29.45,26.14) v1(31.56,5.69) v1(35.05,22.55)
CAN_RX: length 5.2
  Top Layer w0.152: U60.46 31.58,32.2 32.23,31.55 32.23,28.88 32.38,28.72 33.08,28.72
CAN_TX: length 2.4
  Top Layer w0.152: 30.92,32.69 31.77,32.69 32.07,32.4 33.13,32.4 33.18,32.45
CANH: length 12.8
  Top Layer w0.152: U74.7 39.03,31.19 40.72,31.19 ; 39.39,26.7 39.39,26.59 39.8,26.19 41.3,26.19 v1(41.51,26.4) ; v1(42.18,30.72) 42.18,30.82 41.8,31.2 R128.2
  Bottom Layer w0.152: v1(41.51,26.4) 41.75,26.17 41.89,26.17 42.16,26.43 42.16,26.99 40.7,28.45 40.7,30.23 41.03,30.57 41.8,30.57 41.95,30.72 v1(42.18,30.72)
CANL: length 12.8
  Top Layer w0.152: v1(41.48,25.57) 41.17,25.88 39.84,25.88 39.37,25.4 ; R128.1 41.82,29.69 v1(42.18,30.06) ; 40.69,29.65 40.46,29.88 39.06,29.88 U74.6
  Bottom Layer w0.152: 41.51,25.61 41.77,25.61 42.47,26.3 42.47,27.11 41.01,28.57 41.01,30.11 41.16,30.26 41.67,30.26 41.87,30.06 v1(42.18,30.06)
CUR_A: length 10.7
  Top Layer w0.152: U60.8 26.72,34.23 25.17,35.78 25.17,36.57 25.7,37.11 26.82,37.11 27.17,37.46 29.38,37.46 30.09,38.17 31.86,38.17 31.87,38.18
CUR_B: length 8
  Top Layer w0.152: U60.9 26.22,34.23 24.85,35.6 24.85,36.81 25.5,37.46 26.44,37.46 27.17,38.2 28.71,38.2 ; 28.7,38.21 28.71,38.2 ; 28.71,38.2 28.76,38.2
CUR_C: length 7
  Top Layer w0.152: 25.75,33.87 25.75,34.27 24.46,35.56 24.46,37.02 25.66,38.23 25.7,38.23 ; 24.12,38.26 24.13,38.25 25.63,38.25
DCBUS: length 16.7
  Top Layer w0.152: 34.46,40.09 34.5,40.06 34.5,39.42
  Top Layer w0.254: R92.1 33.08,15.72 33.11,15.74 C159.1 C160.1
  Top Layer w0.5: 41.12,20.14 40.31,20.94 36.91,20.94 36.9,20.93 35.74,20.93 33.17,18.37 33.17,18.15 ; R92.1 33.08,13.32 32.3,12.54 U19.5
  vias: v1(34.44,39.42)
LED: length 17.6
  Top Layer w0.152: v1(23.53,35.04) 23.53,34.72 23.9,34.36 24.37,34.36 24.71,34.01 24.71,33.94 ; 13.11,39.4 13.11,40.11 13.81,40.81 18.36,40.81 18.7,40.47 21.46,40.47 v1(21.47,40.46)
  Bottom Layer w0.152: v1(21.47,40.46) 21.47,40.44 21.78,40.12 21.78,36.79 v1(23.53,35.04)
M0_GH_A: length 12.9
  Top Layer w0.152: 16.22,23.25 v1(17.11,23.25) ; v1(20.21,15.26) 20.21,15.77 U20.13
  Inner2 w0.152: v1(20.21,15.26) 20.65,15.69 20.65,18.13 19.77,19.01 17.38,19.01 16.67,19.72 16.67,22.81 v1(17.11,23.25)
M0_GH_B: length 10.1
  Top Layer w0.152: R108.1 v1(17.16,20.05) ; U20.16 21.79,15.82 v1(21.79,15.26)
  Inner2 w0.152: v1(21.79,15.26) 21.79,17.88 19.09,20.58 17.68,20.58 v1(17.16,20.05)
M0_GH_C: length 10.2
  Top Layer w0.152: R23.1 v1(17.2,16.95) ; U20.19 23.37,16.43 v1(23.37,15.89)
  Inner2 w0.152: v1(17.2,16.95) 18.92,16.95 19.55,16.33 19.55,15.22 19.99,14.77 23.09,14.77 23.37,15.06 v1(23.37,15.89)
M0_GL_A: length 6.5
  Top Layer w0.152: 19.62,17.99 19.61,17.98 18.97,17.98 18.59,18.35 18.59,21.02 17.98,21.64 R107.1
M0_GL_B: length 3.7
  Top Layer w0.152: R109.1 17.67,18.49 18.67,17.49 19.62,17.49
M0_GL_C: length 4.3
  Top Layer w0.152: 19.62,16.99 18.94,16.99 18.46,16.51 18.46,15.87 17.98,15.39 R110.1
M0_SH_A: length 41.1
  Top Layer w0.152: 19.62,16.49 19.61,16.48 19.61,16.47 v1(18.98,15.84) ; v1(15.97,9.99) 16,10.02 C107.1 ; v1(4.29,29.42) 5.11,28.6 Q22.9
  Inner2 w0.152: v1(4.29,29.42) 4.32,29.38 8.3,29.38 9.32,28.37 9.32,13.21 13.04,9.5 15.41,9.5 15.91,9.99 v1(15.97,9.99) 17.84,9.99 18.98,11.13 v1(18.98,15.84)
M0_SH_B: length 34
  Top Layer w0.152: v1(19.22,10.12) C108.1 ; v1(21.28,14.27) 21.28,15.83 ; v1(4.1,22.19) 4.1,21.53 Q23.5
  Inner2 w0.152: v1(21.28,14.27) 21.28,10.76 20.63,10.12 v1(19.22,10.12) 19.21,10.12 18.26,9.17 12.94,9.17 8.58,13.52 8.58,20.32 6.75,22.14 4.15,22.14 v1(4.1,22.19)
M0_SH_C: length 29.1
  Top Layer w0.152: Q24.5 4.12,14.75 v1(3.81,15.06) ; v1(22.34,10.21) 22.34,10.99 22.35,11 ; U20.18 22.68,15.73 v1(22.68,14.22)
  Inner2 w0.152: v1(22.68,14.22) 22.68,10.55 v1(22.34,10.21) 20.99,8.86 12.72,8.86 9.29,12.29 6.57,12.29 v1(3.81,15.06)
M0_SP_A: length 25
  Top Layer w0.152: v1(13.09,26.09) 12.74,26.44 10.22,26.44 9.88,26.78 9.88,27.93 9.63,28.18 8.69,28.18 8.67,28.2 ; v1(15.12,40.16) 15.12,39.66 14.79,39.33 R83.2
  Inner1 w0.152: v1(13.09,26.09) 13.47,26.47 13.79,26.47 14.16,26.84 14.16,41 14.41,41.26 15.07,41.26 15.28,41.06 15.28,40.31 v1(15.12,40.16)
M0_SP_B: length 15.5
  Top Layer w0.152: 8.81,20.46 9.84,20.46 10.02,20.28 10.02,19.12 10.41,18.73 12.96,18.73 v1(13.16,18.54) ; R81.2 15.05,26.33 v1(15.05,25.82)
  Inner1 w0.152: v1(15.05,25.82) 15.05,25.7 15.25,25.5 15.25,24.68 12.62,22.05 12.62,19.07 v1(13.16,18.54)
M0_SP_C: length 28.7
  Top Layer w0.152: 21.89,27.33 22.25,26.97 22.25,26.77 ; v1(13.02,10.56) 12.81,10.77 10.67,10.77 10.12,11.32 10.12,12.36 9.93,12.54 U65.2
  Inner1 w0.152: v1(21.89,27.35) 21.62,27.08 21.62,26.32 20.68,25.37 17.81,25.37 14.1,21.66 14.1,11.14 13.76,10.8 13.26,10.8 v1(13.02,10.56)
M0_VB_A: length 7
  Top Layer w0.152: U20.14 20.7,15.75 20.7,14.35 20.32,13.97 18.53,13.97 D10.1 17,12.43 C107.2
M0_VB_B: length 5.2
  Top Layer w0.152: C108.2 20.18,12.53 D11.1 20.75,13.06 22.3,14.6 22.3,15.81 U20.17
M0_VB_C: length 6.3
  Top Layer w0.152: 22.35,12.51 23.38,12.51 D12.1 24.1,13.23 24.1,16.62 23.73,16.99 U20.20
MT6816_1_MISO: length 1.9
  Bottom Layer w0.152: 16.31,21.82 16.31,21.82 16.77,21.82 17.47,22.51 17.94,22.51
MT6816_2_MISO: length 1.9
  Bottom Layer w0.152: 17.01,5.79 17,5.78 16.96,5.78 15.96,4.78 15.63,4.78 15.55,4.87
NMCU_RST: length 14.2
  Top Layer w0.152: 23.16,41.52 23.16,40.42 23,40.27 ; 23.16,41.52 23.11,41.47 22.53,41.47 21.63,42.37 21.25,42.37 ; 23.16,41.52 23.09,41.59 23.09,43 23.04,43.05 23.04,43.14 ; v1(25.91,36.05) 25.93,36.03 25.93,35.52 27.22,34.22 27.22,33.9 U60.7
  Bottom Layer w0.152: v1(25.91,36.05) 25.91,38.53 24.54,39.89 23.24,39.89 v1(22.88,40.25)
OSC_IN: length 2.5
  Top Layer w0.152: 29.34,35.89 29.34,35.76 28.22,34.64 U60.5
OSC_OUT: length 2.3
  Top Layer w0.152: U60.6 27.72,34.68 26.94,35.46 X1.3
REF: length 21.7
  Top Layer w0.152: R77.1 19.22,26.7 R78.1 19.25,27.15 18.84,27.56 v1(18.51,27.56) ; v1(19.53,33.07) 19.61,33.15 19.61,35.66 U16.2 U16.1 ; R76.1 v1(17.72,40.23)
  Inner2 w0.152: v1(19.53,33.07) 19.53,39.85 19.15,40.23 v1(17.72,40.23)
  Bottom Layer w0.152: v1(19.53,33.07) 19.53,33.07 18.51,32.05 v1(18.51,27.56)
SPI1_CSN: length 24.4
  Top Layer w0.152: v1(24.16,26.96) 24.65,26.96 24.69,27
  Bottom Layer w0.152: v1(24.16,26.96) 25.21,26.96 25.71,26.46 25.71,23.25 24.92,23.25 23.13,21.46 20.69,21.46 18.78,19.56 18.78,18.33 18.49,18.04 16.18,18.04 15.18,19.03 15.18,22.79 14.89,23.08 13.99,23.08
SPI1_CSN2: length 54.8
  Top Layer w0.152: 28.68,26.7 28.75,26.62 28.75,26.18
  Bottom Layer w0.152: 13.29,6.07 13.47,5.89 13.55,5.89 14.21,5.23 14.21,3.33 15.53,2.01 17.49,2.01 17.92,2.44 17.92,3.3 18,3.39 18,3.41 18.14,3.54 18.16,3.54 18.26,3.64 19.87,3.64 22.49,6.26 26.11,6.26 ; 28.86,26.11 28.86,26.45 29.53,27.13 36.34,27.13 38.1,25.37 38.1,17.92 34.29,14.12 34.29,11.21 29.83,6.75 26.84,6.75 26.34,6.25
  vias: v1(28.77,26.14)
SPI1_MISO: length 38.7
  Top Layer w0.152: v1(23.21,33.55) 23.21,33.02 23.56,32.67 23.97,32.67
  Bottom Layer w0.152: 14.24,24.17 14,24.17 13.28,23.45 13.28,22.14 13.62,21.8 13.99,21.8 ; v1(23.21,33.55) 22.73,33.55 21.81,32.63 21.81,32.51 21.8,32.5 21.8,29.64 21.61,29.46 ; 18.13,26.37 17.1,25.34 17.1,24.61 16.64,24.15 14.3,24.15 ; 18.13,26.37 18.13,26.4 ; 18.13,26.37 18.33,26.37 18.33,26.36 18.5,26.36 21.61,29.46 ; 21.61,29.46 21.47,29.32 ; 13.93,21.77 14.09,21.61 14.09,12.77 14.4,12.46 14.4,10 13.07,8.67 13.07,7.95 12.22,7.1 12.22,5.15 12.62,4.75 13.03,4.75
SPI1_MOSI: length 55.8
  Top Layer w0.152: v1(14.61,7.12) 14.04,7.69 v1(12.05,7.69) ; 23.11,32.16 23.13,32.18 24,32.18
  Bottom Layer w0.152: 13.97,24.47 16.44,24.47 16.79,24.83 16.79,25.5 18,26.7 18.25,26.7 18.26,26.7 18.35,26.7 21.49,29.84 21.49,33.3 22.3,34.11 23.49,34.11 23.69,33.92 23.69,33.28 23.66,33.25 ; 12.01,7.68 12.01,8.32 13.94,10.25 13.94,12.15 13.64,12.46 13.64,19.97 12.98,20.64 12.98,23.61 13.87,24.5 ; 18.05,24.11 18.04,24.1 17.6,24.1 17.45,24.25 17.45,25.19 18.32,26.06 18.64,26.06 22.1,29.52 22.1,32.37 22.54,32.81 23.23,32.81 23.66,33.24 23.66,33.25 ; 23.07,32.16 23.79,32.88 23.79,33.14 23.77,33.14 23.66,33.25 ; 23.66,33.25 23.65,33.26 ; 17.08,7.31 16.88,7.12 v1(14.61,7.12)
  vias: v1(23.05,32.16)
SPI1_SCK: length 50.9
  Top Layer w0.152: 24,33.15 24,33.57 v1(24.17,33.74)
  Inner2 w0.152: 23.41,14.25 25.64,16.48 25.64,19.84 26.26,20.45
  Bottom Layer w0.152: v1(24.17,33.74) 24.5,33.41 24.5,32.21 23.76,31.47 23.05,31.47 22.41,30.83 22.41,29.34 22.2,29.12 ; 22.2,29.12 23.77,27.55 24.07,27.55 24.07,27.55 26.03,27.55 26.41,27.17 26.41,20.57 v1(26.26,20.42) ; 22.2,29.12 18.79,25.71 18.79,22.02 18.57,21.8 17.71,21.8 17.46,21.56 17.46,21.13 ; 17.02,4.35 17.89,5.22 17.89,7.8 ; 23.4,14.17 23.4,12.93 22.75,12.28 19.32,12.28 17.87,10.83 17.87,7.82
  vias: v1(23.42,14.23)
SWCLK: length 32.3
  Top Layer w0.152: 30.93,27.7 30.93,26.01 30.08,25.16 28.56,25.16 27.03,23.63 25.78,23.63 25.13,22.98 25.13,9.25 24.56,8.68 24.54,8.68 24.49,8.62 18.92,8.62 17.91,7.61 17.91,5.67
SWDIO: length 31.7
  Top Layer w0.152: 30.23,27.08 30.23,25.98 29.8,25.55 28.52,25.55 26.91,23.94 25.4,23.94 24.83,23.37 24.83,9.37 24.44,8.98 18.44,8.98 16.8,7.34 16.8,6.18 16.75,6.12
TIM1_CH1: length 10.3
  Top Layer w0.152: U20.24 23.57,19.12 23.57,23.74 24.86,25.04 26.16,25.04 27.2,26.08 27.2,26.98 27.22,27
TIM1_CH1N: length 9
  Top Layer w0.152: U20.3 21.78,20.35 22.37,20.94 22.37,23.95 24.48,26.06 24.91,26.06 25.22,26.36 25.22,27
TIM1_CH2: length 11.4
  Top Layer w0.152: 27.72,27 27.72,25.94 26.51,24.73 24.99,24.73 24,23.74 24,18.69 23.8,18.49 U20.23
TIM1_CH2N: length 9.3
  Top Layer w0.152: U20.2 22.28,20.37 22.68,20.77 22.68,23.82 24.58,25.73 25.5,25.73 25.72,25.95 25.72,27
TIM1_CH3: length 12
  Top Layer w0.152: 28.22,27 28.22,25.91 26.64,24.33 25.14,24.33 24.41,23.59 24.41,18.67 23.73,17.99 U20.22
TIM1_CH3N: length 9.4
  Top Layer w0.152: U20.1 22.78,19.86 23.08,20.16 23.08,23.8 24.71,25.42 25.8,25.42 26.21,25.83 26.21,26.99 26.22,27
USART1_RX: length 45.6
  Top Layer w0.152: 25.49,5.19 25.49,4.33 26.43,3.38 28.35,3.38 28.98,4.01 28.98,4.68 29.32,5.03 31.75,5.03 32.23,5.5 32.23,6.02 31.15,7.1 26.59,7.1 25.78,7.91 25.78,22.3 26.39,22.91 27.4,22.91 28.8,24.32 30.61,24.32 31.92,25.63 31.92,31.21 31.46,31.67 31.02,31.67
USART1_TX: length 31.1
  Top Layer w0.152: 30.94,31.21 31.35,31.21 31.6,30.97 31.6,25.95 30.36,24.71 28.76,24.71 27.27,23.22 26,23.22 25.47,22.69 25.47,7.65 26.65,6.48 26.65,5.4 ; 26.86,4.4 26.86,4.43 26.86,4.43
$1N155002: length 2.5
  Top Layer w0.152: 13.1,37.79 13.1,35.33 13.08,35.32
$1N159844: length 13.6
  Top Layer w0.152: R23.2 13.12,16.95 12.67,16.51 12.67,14.87 12.21,14.41 8.14,14.41 7.82,14.73 7.82,15.08 7.44,15.46 4.77,15.46 Q21.4
$1N159848: length 16.7
  Top Layer w0.152: Q19.4 4.12,30.36 4.72,29.76 12.85,29.76 13.88,28.74 13.88,23.71 14.37,23.21 14.67,23.21 R106.2
$1N159849: length 12.2
  Top Layer w0.152: Q20.4 4.74,22.63 7.64,22.63 7.98,22.29 12.51,22.29 R108.2
$1N159852: length 8.5
  Top Layer w0.152: Q24.4 7.76,14.35 8.01,14.11 12.51,14.11 12.98,14.57 12.98,14.86 13.5,15.39 R110.2
$1N159862: length 10.2
  Top Layer w0.152: R109.2 14.43,18.49 14.1,18.82 14.1,20.27 12.41,21.96 7.57,21.96 Q23.4
$1N159870: length 15
  Top Layer w0.152: R107.2 14.71,21.61 14.12,21.61 13.57,22.16 13.57,28.46 12.57,29.46 7.72,29.46 Q22.4
$1N176512: length 5
  Top Layer w0.152: R20.1 R21.2 20.77,37.33 20.21,36.77 19.14,36.77 18.98,36.61 U16.3
$1N176515: length 23.7
  Top Layer w0.152: U16.8 16.38,31.77 v1(16.16,31.99) R71.2 ; v1(28.6,40.69) 28.6,39.69 28.49,39.58 28.49,39.56
  Inner1 w0.152: v1(28.6,40.69) 28.08,41.21 21.12,41.21 17.72,37.82 17.72,34.51 16.16,32.95 v1(16.16,31.99)
$1N176518: length 5.8
  Top Layer w0.152: U16.9 17.03,29.33 16.71,29 15.64,29 ; R81.1 14.85,28.21 15.64,29 ; 15.64,29 15.64,30.07 15.23,30.48 R71.1
$1N176519: length 3.5
  Top Layer w0.152: U16.10 17.68,28.27 R77.2 R82.1
$1N176520: length 3.7
  Top Layer w0.152: U16.5 17.72,35.73 R76.2 R84.1
$1N176521: length 5.9
  Top Layer w0.152: 15.01,36.83 16.93,36.83 17.04,36.72 17.04,35.69 U16.6 ; 15.01,36.83 14.57,37.26 R83.1 ; 15.01,36.83 15.01,35.78 R75.1
$1N176522: length 25.8
  Top Layer w0.152: v1(31.07,40.82) 31.08,40.82 31.59,40.3 31.59,39.7 31.51,39.62 ; U16.7 16.38,34.22 v1(16.06,33.89) R75.2
  Inner1 w0.152: v1(31.07,40.82) 29.56,40.82 28.7,41.69 19.86,41.69 16.78,38.61 16.78,34.62 v1(16.06,33.89)
$1N176541: length 18
  Top Layer w0.152: v1(20.62,31.87) 20.86,32.1 21.61,32.1 21.66,32.06 ; v1(24.1,40.46) 24.1,39.73 24.11,39.72 ; 21.66,32.06 21.66,32.06 ; 21.66,32.06 21.66,31.28 21.45,31.07 20.86,31.07 20.29,30.5 20.29,30.11
  Inner1 w0.152: 24.12,40.39 24.09,40.36 24.09,39.19 23.66,38.76 21.33,38.76 18.89,36.32 18.89,32.76 19.78,31.87 v1(20.62,31.87)
$1N176544: length 3.5
  Top Layer w0.152: U16.12 18.98,29.36 19.25,29.1 R78.2 R80.1
$1N176545: length 9.1
  Top Layer w0.152: 21.73,33.56 21.67,33.62 20.92,33.62 19.68,32.38 19.68,30.13 U16.13 19.68,30.04 19.68,29.13 19.91,28.9 22.04,28.9 22.27,28.67 R79.1
$1N177495: length 2.3
  Top Layer w0.152: 32.99,10.12 32.99,11.12 33.46,11.59 U19.1
$1N177496: length 4.5
  Top Layer w0.152: U19.6 31.76,9.83 L3.1 32.29,9.32 32.99,8.61
$1N177500: length 3.7
  Top Layer w0.152: 35.35,13.6 34.27,13.6 34.13,13.46 ; 37,11.93 37,12.08 35.45,13.62 35.38,13.62
$1N177501: length 1.7
  Top Layer w0.152: 31.76,13.49 31.76,14.95 R92.2
$1N187186: length 2.9
  Bottom Layer w0.152: 24.44,19.85 25.27,19.85 25.59,20.17 25.59,21.75
$1N187228: length 7.2
  Bottom Layer w0.152: 23.18,25.08 23.18,23.81 22.72,23.35 20.91,23.35 20.41,22.85 20.41,21.81 19.77,21.17 19,21.17 19,21.18
$1N187273: length 3.5
  Bottom Layer w0.152: 19.56,22.62 19.59,22.62 20.8,23.83 21.55,23.83 21.85,24.12 21.85,24.73
$1N187318: length 2
  Bottom Layer w0.152: 20.61,25 20.59,24.98 20.59,24.29 20.44,24.14 19.41,24.14
$1N193710: length 4.8
  Bottom Layer w0.152: 21.89,8.12 21.89,7.03 20.62,5.77 18.67,5.77
$1N193711: length 2.2
  Bottom Layer w0.152: 20.6,7.98 19.92,7.3 18.68,7.3
$1N193712: length 3.2
  Bottom Layer w0.152: 26.14,4.78 26.14,3.66 25.28,2.8 24.44,2.8
$1N193722: length 6.1
  Bottom Layer w0.152: 18.72,4.37 20.1,4.37 23.09,7.37 23.09,7.81 23.11,7.83

## Copper pours and planes (outline as drawn; the poured copper is in the pictures)
5V on Top Layer: 26.95,10.68 29.97,10.68 29.97,8.05 26.95,8.05
GND on Top Layer: 33.52,12.88 36.05,12.88 36.05,11.57 33.52,11.57
GND on Top Layer: 28.76,18.63 32.14,18.63 32.14,15.94 28.76,15.94
GND on Top Layer: 14.14,51.44 56.24,51.44 56.24,-2.92 14.14,-2.92
GND on Bottom Layer: 14.99,45.54 47.05,45.54 47.05,-1.08 14.99,-1.08
GND on Inner1: 20.81,35.41 20.8,35.41 20.8,33.37 20.8,33.37 20.8,32.66 23.05,30.41 24.69,30.41 24.7,30.42 24.7,23.55 24.7,23.54 18.61,23.54 17.85,22.78 17.85,-2.2 17.84,-2.2 45.21,-2.2 45.21,-2.2 45.21,38.01 45.21,38.01 23.41,38.01
GND on Inner1: 26.99,44.83 26.99,42.03 29.69,42.03 30.26,41.46 31.33,41.46 33.31,39.48 33.31,36.99 39.95,36.99 39.95,36.98 39.95,44.81 39.94,44.82 27,44.82
PGND on Top Layer: 10.39,34.13 11.9,34.13 11.9,32.18 10.39,32.18
PGND on Top Layer: 10.85,13.65 12.36,13.65 12.36,11.57 10.85,11.57
PGND on Top Layer: 11.16,33.5 11.94,33.5 11.94,30 11.16,30
PGND on Top Layer: 10.62,24.18 12.18,24.18 12.18,22.54 10.62,22.54
PGND on Top Layer: 10.62,18.44 12.18,18.44 12.18,16.85 10.62,16.85
PGND on Top Layer: 10.62,16.44 12.18,16.44 12.18,14.8 10.62,14.8
PGND on Top Layer: 10.64,26.18 12.2,26.18 12.2,24.53 10.64,24.53
PGND on Top Layer: 10.75,21.52 12.26,21.52 12.26,19.43 10.75,19.43
PGND on Top Layer: 10.41,31.89 11.91,31.89 11.91,30.02 10.41,30.02
PGND on Top Layer: 10.71,29.09 12.22,29.09 12.22,27.1 10.71,27.1
PGND on Bottom Layer: 10.05,33.58 12.42,33.58 12.42,11.48 10.05,11.48
PGND on Inner1: 9.99,34.34 12.4,34.34 12.4,11.38 9.99,11.38
PGND on Inner2: 10.15,26.57 15.35,26.51 27.79,18.43 27.71,12.48 45.03,12.27 45,18.48 32.02,18.44 32.05,21.26 32.13,30.62 10.15,30.78
PGND on Inner2: 9.64,13.6 11.86,11.43 12.32,11.43 12.32,31.11 12.28,31.15 10.14,31.15 9.73,31.12
DCBUS on Top Layer: 4.82,18.44 9.16,18.44 9.16,14.72 4.82,14.72
DCBUS on Top Layer: 4.8,26.22 9.29,26.22 9.29,22.52 4.8,22.52
DCBUS on Top Layer: 32.56,18.69 33.64,18.69 33.64,14.52 32.56,14.52
DCBUS on Top Layer: 4.82,18.43 9.29,18.43 9.29,14.76 8.35,14.76 8.35,15.74 4.82,15.74
DCBUS on Top Layer: 4.85,33.57 8.95,33.57 8.95,30.01 4.85,30.01
DCBUS on Bottom Layer: 4.82,33.62 9.29,33.62 9.29,14.55 4.82,14.55
DCBUS on Inner1: 4.73,33.59 7.73,33.59 7.73,11.77 4.73,11.77
DCBUS on Inner2: -1.97,4.85 9.09,4.85 9.09,31.94 14.89,31.96 14.91,38.13 27.94,38.05 32.59,33.6 32.59,19.2 49.4,19.03 49.41,21.83 49.41,45.64 49.4,45.65 -1.88,45.65 -1.97,45.56
M0_SH_A on Top Layer: 0.55,32.81 6.14,32.81 6.14,26.41 0.55,26.41
M0_SH_B on Top Layer: 0.24,25.75 6.24,25.75 6.24,19.15 0.24,19.15
M0_SH_C on Top Layer: 0.61,18.31 6.35,18.31 6.35,12.03 0.61,12.03
M0_SP_A on Top Layer: 6.62,29.04 9.11,29.04 9.11,26.59 6.62,26.59
M0_SP_B on Top Layer: 6.73,21.31 9.19,21.31 9.19,19.21 6.73,19.21
M0_SP_C on Top Layer: 6.83,13.92 9.24,13.92 9.24,11.68 6.83,11.68
M0_SP_C on Top Layer: 6.85,13.92 9.21,13.92 9.21,11.68 6.85,11.68
$1N177496 on Top Layer: 30.5,12.03 33.75,12.03 33.75,7.76 30.5,7.76

Small or netless copper shapes (teardrops, artwork), in the pictures only: 1 on Top Layer

## Text on the board
Bottom Silkscreen Layer: H | L | Date:2024-12-05 | Designed by YYT
Top Silkscreen Layer: H | L
